# Altium schematic sheet 主板.SchDoc
size A4
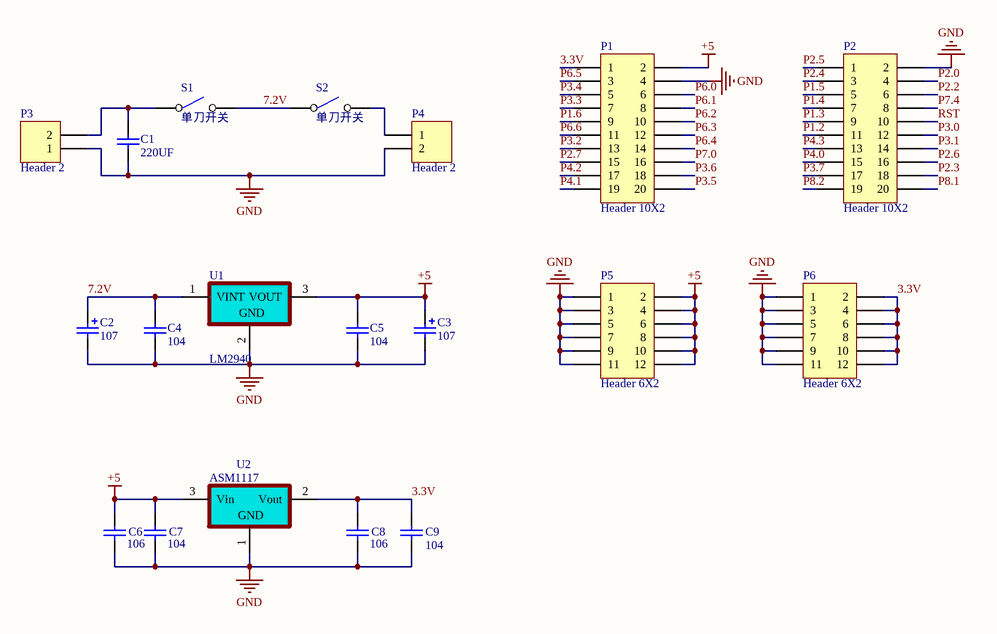
[diagram p0: 主板.SchDoc]

## Parts
C1  220UF  [C-T电解F-330uF]
C2  107  [107J/106E钽电容]
C3  107  [107J/106E钽电容]
C4  104  [0603AC]
C5  104  [0603AC]
C6  106  [0603AC]
C7  104  [0603AC]
C8  106  [0603AC]
C9  104  [0603AC]
P1  Header 10X2  [HDR2X10]
P2  Header 10X2  [HDR2X10]
P3  Header 2  [T型插]
P4  Header 2  [Con 2接线端子]
P5  Header 6X2  [HDR2X6]
P6  Header 6X2  [HDR2X6]
S1  单刀开关  [船型开关（小2脚）]
S2  单刀开关  [船型开关（小2脚）]
U1  LM2940  [LM2940]
U2  ASM1117  [AMS1117]

## Nets
+5: C3.1 C5.2 C6.2 C7.2 P1.2 P5.2 P5.4 P5.6 P5.8 P5.10 P5.12 U1.3(VOUT) U2.3(Vin)
GND: C1.2 C2.2 C3.2 C4.1 C5.1 C6.1 C7.1 C8.1 C9.1 P1.4 P2.2 P3.1 P4.2 P5.1 P5.3 P5.5 P5.7 P5.9 P5.11 P6.1 P6.3 P6.5 P6.7 P6.9 P6.11 U1.2(GND) U2.1(Gnd)
3.3V: C8.2 C9.2 P1.1 P6.2 P6.4 P6.6 P6.8 P6.10 P6.12 U2.2(Vout)
7.2V: C2.1 C4.2 S1.2 S2.1 U1.1(VINT)
P1.2: P2.11
P1.3: P2.9
P1.4: P2.7
P1.5: P2.5
P1.6: P1.9
P2.0: P2.4
P2.2: P2.6
P2.3: P2.18
P2.4: P2.3
P2.5: P2.1
P2.6: P2.16
P2.7: P1.15
P3.0: P2.12
P3.1: P2.14
P3.2: P1.13
P3.3: P1.7
P3.4: P1.5
P3.5: P1.20
P3.6: P1.18
P3.7: P2.17
P4.0: P2.15
P4.1: P1.19
P4.2: P1.17
P4.3: P2.13
P6.0: P1.6
P6.1: P1.8
P6.2: P1.10
P6.3: P1.12
P6.4: P1.14
P6.5: P1.3
P6.6: P1.11
P7.0: P1.16
P7.4: P2.8
P8.1: P2.20
P8.2: P2.19
RST: P2.10
NetC1_1: C1.1 P3.2 S1.1
NetP4_1: P4.1 S2.2

## Notes on the sheet
- (in symbol ASM1117) GND

## Library data of the parts
C1 = Cap: Capacitor; 220UF: EC; Published: 8-Jun-2000; LatestRevisionDate: 17-Jul-2002; LatestRevisionNote: Re-released for DXP Platform.; PackageReference: RAD-0.3; Publisher: Altium Limited; PackageDescription: Radial Cap, Thru-Hole; 2 Leads; 0.3 in Pin Spacing
C2 C3 = Cap Pol2: Polarized Capacitor (Axial); Value: 100pF; Published: 8-Jun-2000; LatestRevisionDate: 17-Jul-2002; LatestRevisionNote: Re-released for DXP Platform.; PackageReference: POLAR0.8; Publisher: Altium Limited; PackageDescription: Polarized Capacitor; 2 Leads
C4-C9 = Cap: Capacitor; Value: 100pF; Published: 8-Jun-2000; LatestRevisionDate: 17-Jul-2002; LatestRevisionNote: Re-released for DXP Platform.; PackageReference: RAD-0.3; Publisher: Altium Limited; PackageDescription: Radial Cap, Thru-Hole; 2 Leads; 0.3 in Pin Spacing
P1 P2 = Header 10X2: Header, 10-Pin, Dual row; LatestRevisionDate: 17-Jul-2002; LatestRevisionNote: Re-released for DXP Platform.; Publisher: Altium Limited
P3 P4 = Header 2: Header, 2-Pin; LatestRevisionDate: 17-Jul-2002; LatestRevisionNote: Re-released for DXP Platform.; Publisher: Altium Limited
P5 P6 = Header 6X2: Header, 6-Pin, Dual row; LatestRevisionDate: 17-Jul-2002; LatestRevisionNote: Re-released for DXP Platform.; Publisher: Altium Limited
U2 = ASM1117: ASM1117系列SOT-223封装稳压芯片